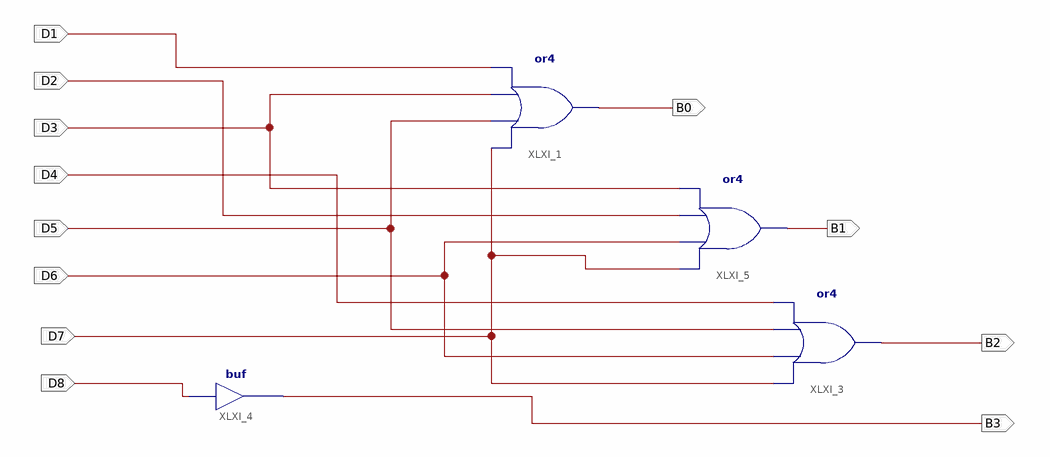
[diagram p0: schematic sheet 1]
// Xilinx ISE schematic encoder8DEC_BIN.sch (spartan6) as structural Verilog: 4 symbols, 12 ports
module encoder8DEC_BIN (
  input  D1,
  input  D2,
  input  D3,
  input  D4,
  input  D5,
  input  D6,
  input  D7,
  input  D8,
  output B0,
  output B2,
  output B3,
  output B1
);

  or XLXI_1 (B0, D7, D5, D3, D1);
  or XLXI_3 (B2, D7, D6, D5, D4);
  buf XLXI_4 (B3, D8);
  or XLXI_5 (B1, D7, D6, D2, D3);
endmodule
